# Altium schematic sheet Schematic.SchDoc
size 431 x 279 mm; SheetNumber: 1; SheetTotal: 2; ENG_APP_DATE: --/--/--; DSN_APP_DATE: --/--/--; CHK_APP_DATE: --/--/--
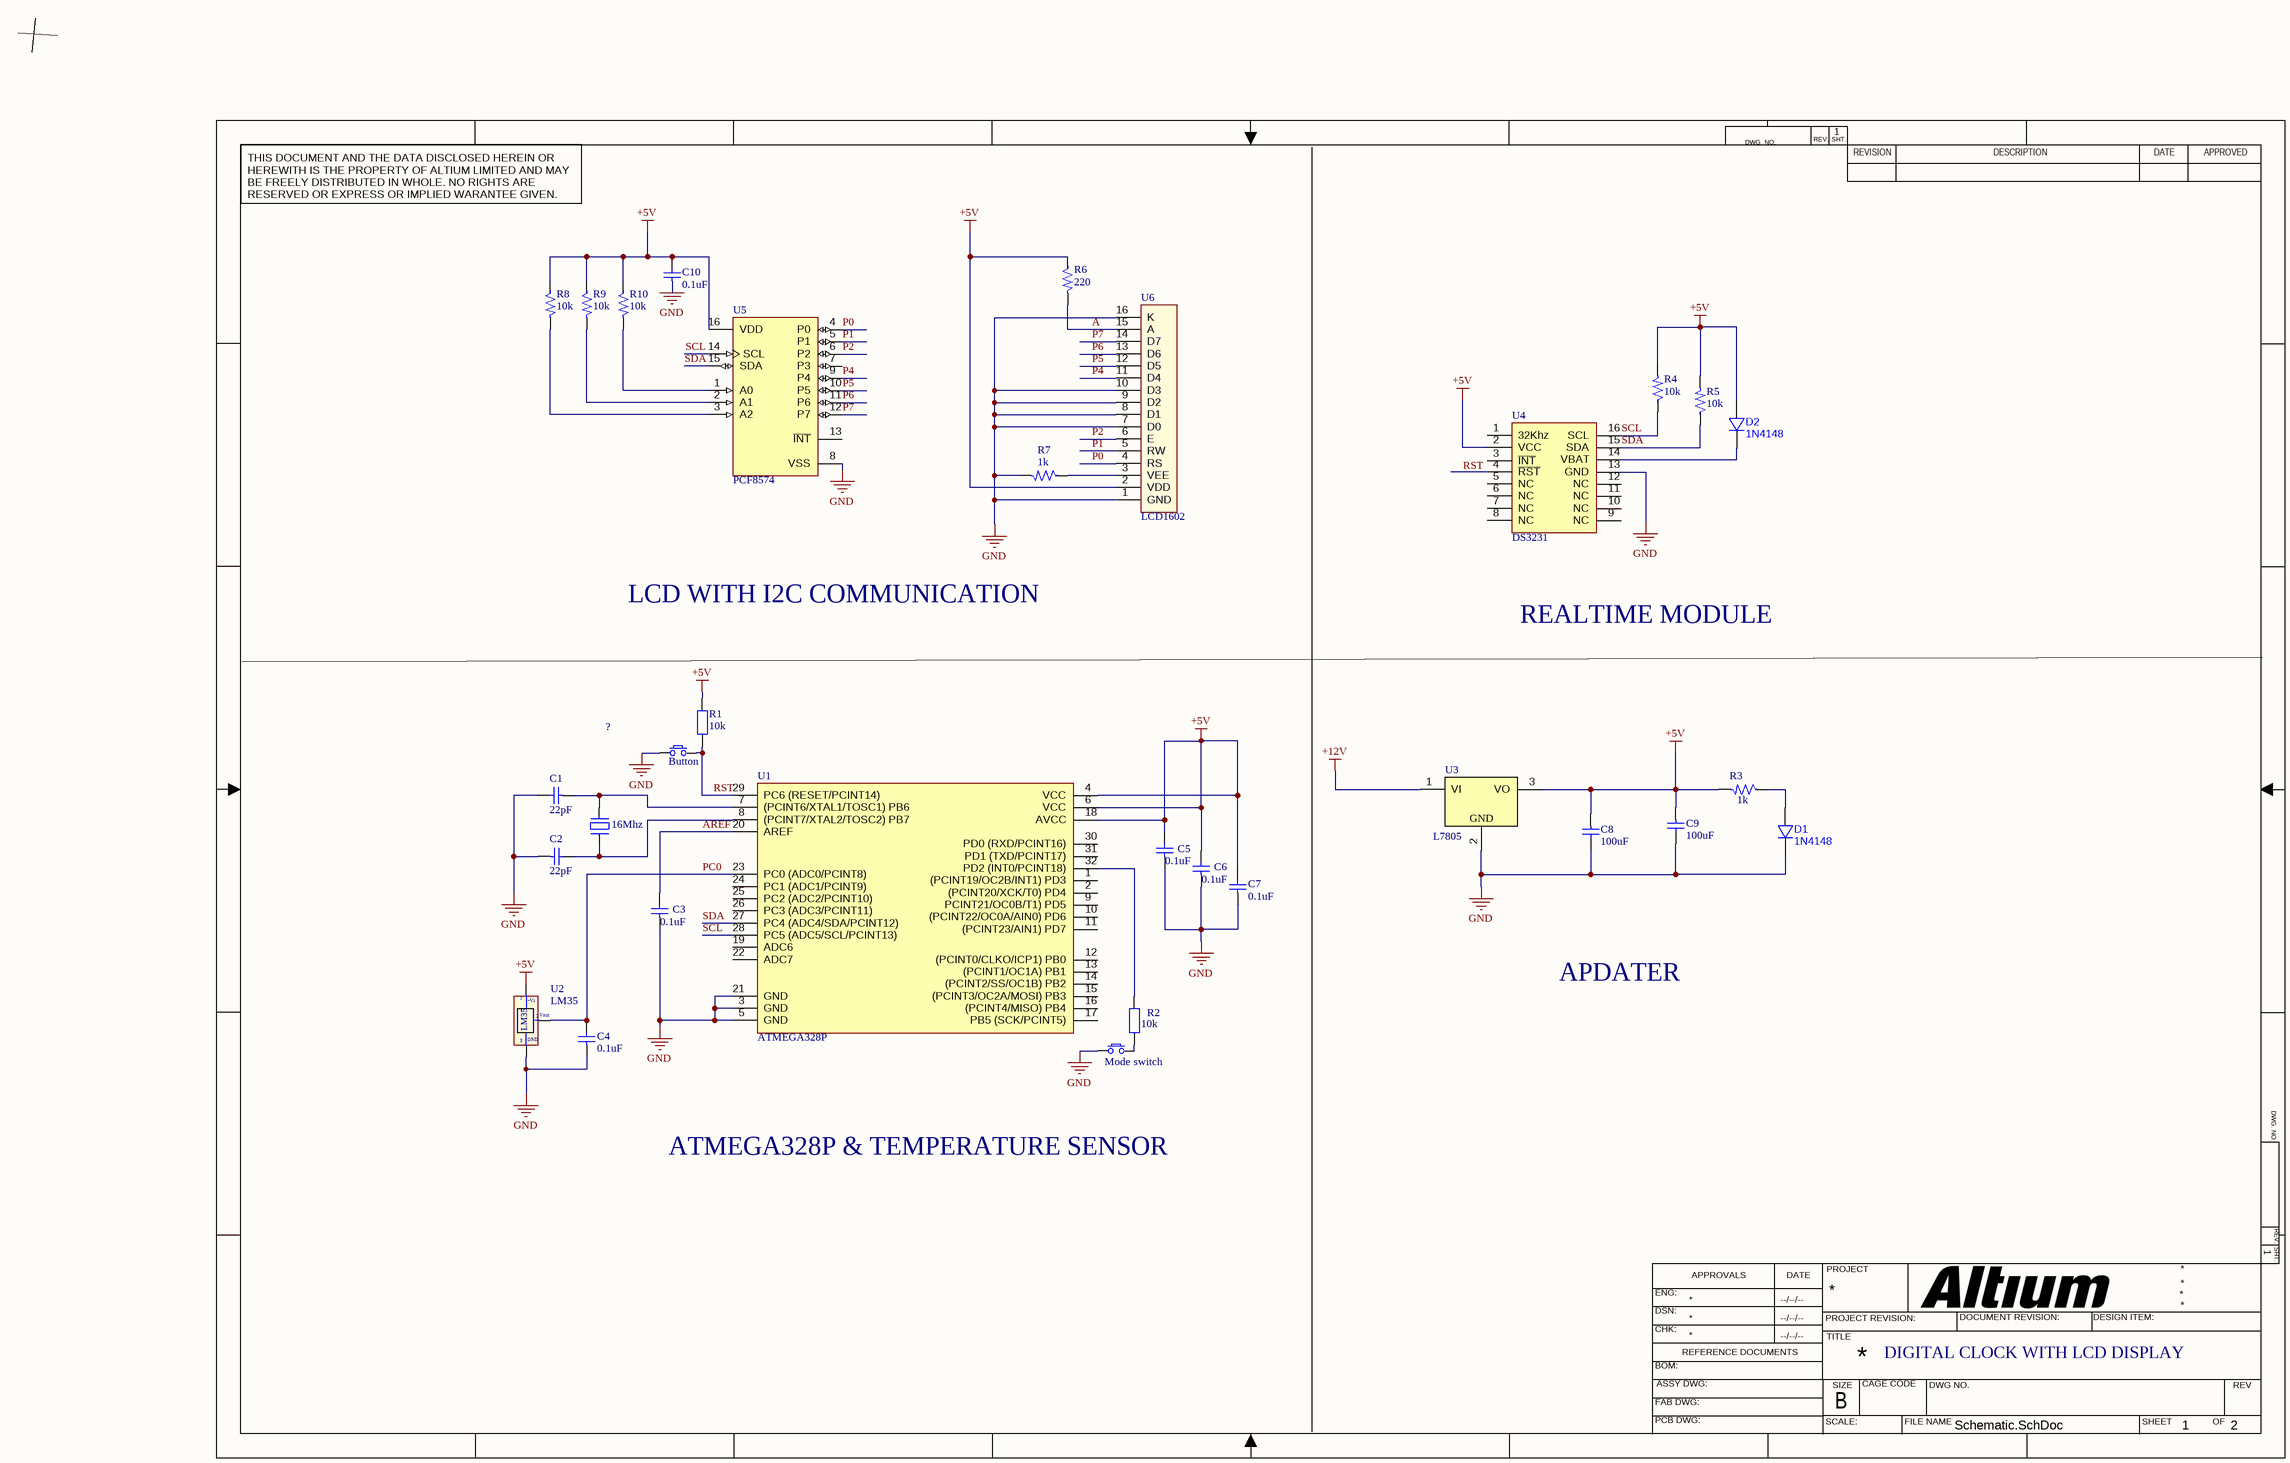
[diagram p0: Schematic.SchDoc]

## Parts
(Parts that share a designator on the sheet are numbered #1, #2 ... from top to bottom, then left to right.)
?#1  Button  [SW/2/DIP]
?#2  16Mhz  [Thach Anh 2 chan SMD]
C1  22pF  [C 0402 (1005)]
C2  22pF  [C 0402 (1005)]
C3  0.1uF  [C 0402 (1005)]
C4  0.1uF  [C 0402 (1005)]
C5  0.1uF  [C 0402 (1005)]
C6  0.1uF  [C 0402 (1005)]
C7  0.1uF  [C 0402 (1005)]
C8  100uF  [C 0402 (1005)]
C9  100uF  [C 0402 (1005)]
C10  0.1uF  [C 0402 (1005)]
D1  1N4148  [SOD523F]
D2  1N4148  [SOD523F]
Mode_switch  (no value)  [SW/2/DIP]
R1  10k  [tro vach 1/4w]
R2  10k  [tro vach 1/4w]
R3  1k  [R1/4W]
R4  10k  [R1/4W]
R5  10k  [R1/4W]
R6  220  [R1/4W]
R7  1k  [R1/4W]
R8  10k  [SM-RES-1206]
R9  10k  [SM-RES-1206]
R10  10k  [SM-RES-1206]
U1  ATMEGA328P  [TQFP-32]
U2  LM35  [QTO-92]
U3  L7805  [DPAK_118_446_112X59_SMD]
U4  DS3231  [SOIC 16]
U5  PCF8574  [FP-SOT162-1-MFG]
U6  LCD1602  [LCD1602 with Jump]

## Nets
+5V: C5.2 C6.2 C7.2 C8.1 C9.1 C10.2 D2.A R1.2 R3.2 R4.2 R5.2 R6.1 R8.1 R9.1 R10.1 U1.4(VCC) U1.6(VCC) U1.18(AVCC) U2.1(+Vs) U3.3(VO) U4.2(VCC) U5.16(VDD) U6.2(VDD)
+12V: U3.1(VI)
GND: ?#1.1 C1.2 C2.1 C3.1 C4.1 C5.1 C6.1 C7.1 C8.2 C9.2 C10.1 D1.K Mode_switch.1 R7.2 U1.3(GND) U1.5(GND) U1.21(GND) U2.3(-) U3.2 U4.13(GND) U5.8(VSS) U6.1(GND) U6.7(D0) U6.8(D1) U6.9(D2) U6.10(D3) U6.16(K)
A: R6.2 U6.15(A)
AREF: C3.2 U1.20(AREF)
P0: U5.4(P0) U6.4(RS)
P1: U5.5(P1) U6.5(RW)
P2: U5.6(P2) U6.6(E)
P4: U5.9(P4) U6.11(D4)
P5: U5.10(P5) U6.12(D5)
P6: U5.11(P6) U6.13(D6)
P7: U5.12(P7) U6.14(D7)
PC0: C4.2 U1.23(PC0_(ADC0/PCINT8)) U2.2(Vout)
RST: ?#1.2 R1.1 U1.29(PC6_(RESET/PCINT14))
SCL: R4.1 U1.28(PC5_(ADC5/SCL/PCINT13)) U4.16(SCL) U5.14(SCL)
SDA: R5.1 U1.27(PC4_(ADC4/SDA/PCINT12)) U4.15(SDA) U5.15(SDA)
Net?#2_1: ?#2.1 C2.2 U1.8((PCINT7/XTAL2/TOSC2)_PB7)
Net?#2_2: ?#2.2 C1.1 U1.7((PCINT6/XTAL1/TOSC1)_PB6)
NetD1_A: D1.A R3.1
NetD2_K: D2.K U4.14(VBAT)
NetMode_switch_2: Mode_switch.2 R2.1
NetR2_2: R2.2 U1.32(PD2_(INT0/PCINT18))
NetR7_1: R7.1 U6.3(VEE)
NetR8_2: R8.2 U5.3(A2)
NetR9_2: R9.2 U5.2(A1)
NetR10_2: R10.2 U5.1(A0)

Not connected (* = marked no-connect by the designer): U1 1((PCINT19/OC2B/INT1)_PD3) 2((PCINT20/XCK/T0)_PD4) 9(PCINT21/OC0B/T1)_PD5) 10((PCINT22/OC0A/AIN0)_PD6) 11((PCINT23/AIN1)_PD7) 12((PCINT0/CLKO/ICP1)_PB0) 13((PCINT1/OC1A)_PB1) 14((PCINT2/SS/OC1B)_PB2) 15((PCINT3/OC2A/MOSI)_PB3) 16((PCINT4/MISO)_PB4) 17(PB5_(SCK/PCINT5)) 19(ADC6) 22(ADC7) 24(PC1_(ADC1/PCINT9)) 25(PC2_(ADC2/PCINT10)) 26(PC3_(ADC3/PCINT11)) 30(PD0_(RXD/PCINT16)) 31(PD1_(TXD/PCINT17)); U4 1(32Khz) 3(~{INT}) 4(~{RST}) 5(NC) 6(NC) 7(NC) 8(NC) 9(NC) 10(NC) 11(NC) 12(NC); U5 7(P3) 13(~{INT})

## Notes on the sheet
- LCD WITH I2C COMMUNICATION
- REALTIME MODULE
- APDATER
- ATMEGA328P & TEMPERATURE SENSOR
- DIGITAL CLOCK WITH LCD DISPLAY
- Labels drawn without touching a wire or pin: RST
- DWG. NO.
- REV.
- SHT.
- THIS DOCUMENT AND THE DATA DISCLOSED HEREIN OR HEREWITH IS THE PROPERTY OF ALTIUM LIMITED AND MAY BE FREELY DISTRIBUTED IN WHOLE. NO RIGHTS ARE RESERVED OR EXPRESS OR IMPLIED WARANTEE GIVEN.
- REVISION
- DESCRIPTION
- DATE
- APPROVED
- ENG:
- APPROVALS
- PROJECT
- DSN:
- CHK:
- REFERENCE DOCUMENTS
- PROJECT REVISION:
- TITLE
- DOCUMENT REVISION:
- DESIGN ITEM:
- BOM:
- FAB DWG:
- PCB DWG:
- ASSY DWG:
- SCALE:
- SIZE
- B
- CAGE CODE
- FILE NAME
- DWG NO.
- SHEET
- OF
- REV
- (in symbol LM35) GND
- (in symbol REG_35V_5V-1.5A-7.5W-DPAK) GND

## Library data of the parts
?#1 Mode_switch = SW SPST: Tact switch 2 pin
?#2 = Thach Anh 2 chan SMD: Crystal For all Crystal 2pin.; Value: 4Mhz
C1-C10 = Capacitor NP: Capacitor non-pol
D1 D2 = DIODE_1N4148_200mA_SOD523F: Diode SMD small signal 0.2A SOD-523F; Manufacturer 1: Fairchild Semiconductor; Manufacturer Part Number 1: 1N4148WT; Ratings: Vr=75V; Vf=1V@10mA; Io=200mA; Material: Si; SCDType: source; Package / Case: SC-79, SOD-523F; Supplier 1: Digi-Key; Supplier Part Number 1: 1N4148WTCT-ND; ComponentLink1URL: http://www.fairchildsemi.com/ds/1N/1N914BWT.pdf; ComponentLink1Description: http://www.fairchildsemi.com/ds/1N/1N914BWT.pdf; Value: 1N4148
R1 R2 = Tro Vach 1/4W 5% 10k: Căm; Chung_Loai: Cắm; Don_Vi: Con; So_Chan: 2; Ten_Linh_Kien: Trở Vạch 1/4w 5% 10K; Ma_Hang: MH007354; Kieu_Chan: *
R3-R7 = Res
R8-R10 = R: Resistor 1/4W; Value: R1/4W - 1K
U1 = IC_ATMEGA328P: AVR AVR® ATmega Microcontroller IC 8-Bit 20MHz 32KB (16K x 16) FLASH 32-TQFP (7x7); Manufacturer: Microchip Technology; Manufacturer Part Number: ATMEGA328P-AUR; Alternate Part Number-1: NA; Case/Package: 32-TQFP; Supplier-1: Arrow; Supplier Part Number-1: ATMEGA328P-AUR
U2 = LM35: Teminal; Value: LM35
U3 = REG_35V_5V-1.5A-7.5W-DPAK: Linear Voltage Regulator IC 1 Output 1.5A DPAK; Manufacturer: Diodes; Manufacturer Part Number: L7805CDT-TR; Alternate Part Number-1: CJ7805 3%; Case/Package: DPAK; Supplier-1: SP ROAD; Supplier Part Number-1: L7805CDT-TR
U4 = DS3231 SMD: SOIC
U5 = CMP-10112-000010-1: IC I/O EXPANDER I2C 8B 16SOIC; Manufacturer Part Number: PCF8574T/3,518; Manufacturer: NXP Semiconductors; Frequency: 100kHz; Max Supply Voltage: 6V; Standoff Height: 0.1mm; Nominal Supply Current: 40uA; Max Junction Temp: +125°C; Min Supply Voltage: 2.5V; Number Of I/Os: 8; Footprint Url: https://www.nxp.com/docs/en/package-information/SOT162-1.pdf; ComponentLink2URL: https://www.nxp.com/docs/en/data-sheet/PCF8574_PCF8574A.pdf; Automotive: No; Digikey Description: IC I/O EXPANDER I2C 8B 16SOIC; Mouser Description: PCF8574 Series 2.5 - 6V Remote 8-bit I/O Expander for I2C-bus - SOIC-16; Ipc Land Pattern Name: SOIC127P1032X265-16; Interface: I2C; Octopart: https://octopart.com/pcf8574t%2F3%2C518-nxp+semiconductors-10470852; Ambient Temperature Range Low: -40°C; Lead Free: Yes; Device Class L2: Interface ICs; Temperature Range High: +85°C; Device Class L1: Integrated Circuits (ICs); Package: SOT162-1; ComponentLink2Description: Datasheet; Device Class L3: I/O Expanders; Temperature: -40°C to +85°C; Ambient Temperature Range High: +85°C; Height: 2.65mm; Category: IC; RoHS: TRUE; Temperature Range Low: -40°C
U6 = LCD1602 XL: LCD 1602 Xanh Lá; Ten: Màn hình LCD 1602 Xanh Lá; Ma_Hang: 67HZ; NCC: NSHOP; CHIP: HD44780